# EAGLE design mainBoard (EAGLE 6.3)
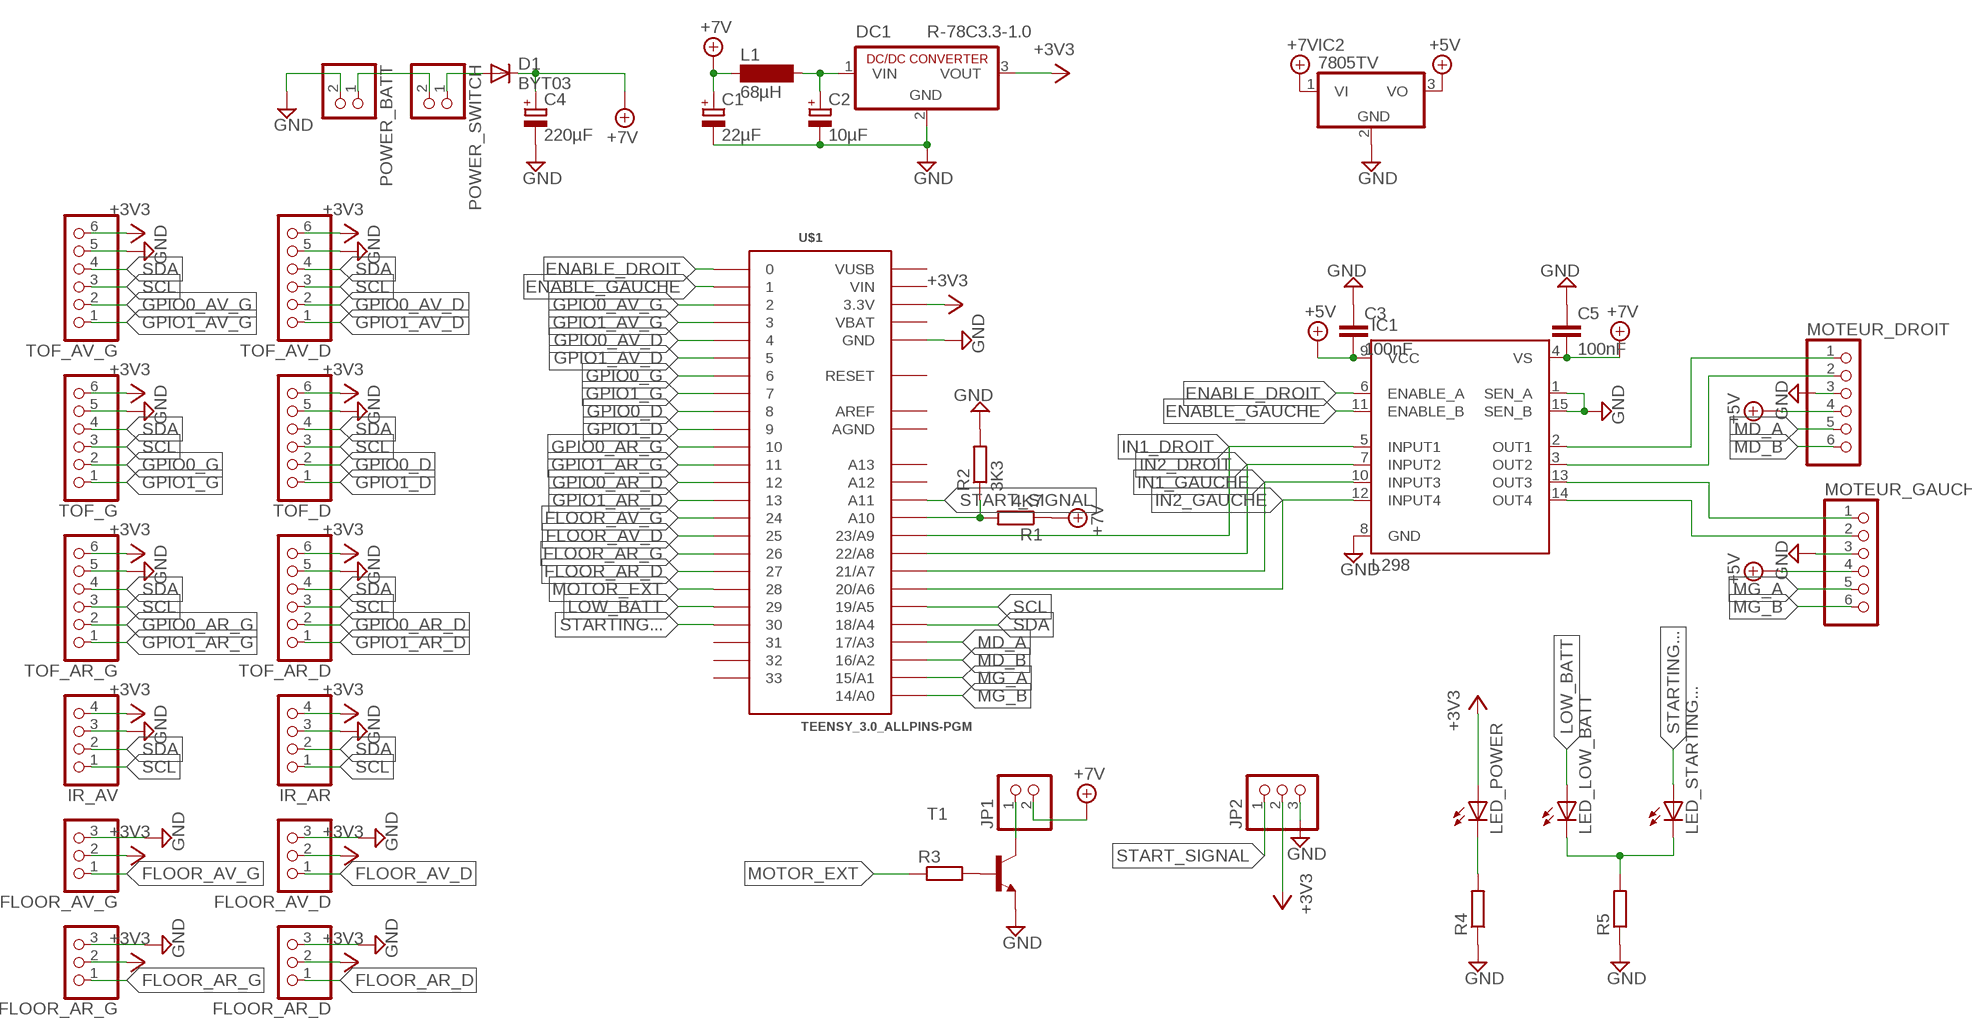
[diagram p0: schematic, sheet 1]

## Parts
C1  22µF  CPOL-EUE2,5-6E  [E2,5-6E]
C2  10µF  CPOL-EUE2,5-6E  [E2,5-6E]
C3  100nF  C-EU050-024X044  [C050-024X044]
C4  220µF  CPOL-EUE2.5-7  [E2,5-7]
C5  100nF  C-EU050-024X044  [C050-024X044]
D1  BYT03  [DO27-15]
DC1  R-78C3.3-1.0  [SIP3]
FLOOR_AR_D  PINHD-1X3  [1X03]
FLOOR_AR_G  PINHD-1X3  [1X03]
FLOOR_AV_D  PINHD-1X3  [1X03]
FLOOR_AV_G  PINHD-1X3  [1X03]
IC1  L298  [MULTIWATT-15]
IC2  7805TV  [TO220V]
IR_AR  PINHD-1X4  [1X04]
IR_AV  PINHD-1X4  [1X04]
JP1  PINHD-1X2  [1X02]
JP2  PINHD-1X3  [1X03]
L1  68µH  BS11  [BS11]
LED_LOW_BATT  LED3MM  [LED3MM]
LED_POWER  LED3MM  [LED3MM]
LED_STARTING...  LED3MM  [LED3MM]
MOTEUR_DROIT  PINHD-1X6  [1X06]
MOTEUR_GAUCHE  PINHD-1X6  [1X06]
POWER_BATT  PINHD-1X2  [1X02]
POWER_SWITCH  PINHD-1X2  [1X02]
R1  4K7  R-EU_0204/7  [0204/7]
R2  3K3  R-EU_0204/7  [0204/7]
R3  R-EU_0204/7  [0204/7]
R4  R-EU_0204/7  [0204/7]
R5  R-EU_0207/2V  [0207/2V]
T1  2N4124-NPN-TO92-CBE  [TO92-CBE]
TOF_AR_D  PINHD-1X6  [1X06]
TOF_AR_G  PINHD-1X6  [1X06]
TOF_AV_D  PINHD-1X6  [1X06]
TOF_AV_G  PINHD-1X6  [1X06]
TOF_D  PINHD-1X6  [1X06]
TOF_G  PINHD-1X6  [1X06]
U$1  TEENSY_3.0_ALLPINS-PGM  [TEENSY_3.0_ALLPINS-PGM]

## Nets
+3V3: DC1.3(VOUT) FLOOR_AR_D.2 FLOOR_AR_G.2 FLOOR_AV_D.2 FLOOR_AV_G.2 IR_AR.4 IR_AV.4 JP2.2 LED_POWER.A TOF_AR_D.6 TOF_AR_G.6 TOF_AV_D.6 TOF_AV_G.6 TOF_D.6 TOF_G.6 U$1.3.3V U$1.3.3V1(3.3V) U$1.3.3V2(3.3V)
+5V: C3.2 IC1.9(VCC) IC2.3(VO) MOTEUR_DROIT.4 MOTEUR_GAUCHE.4
+7V: C1.+ C4.+ C5.2 D1.C IC1.4(VS) IC2.1(VI) JP1.2 L1.1 R1.1
ENABLE_DROIT: IC1.6(ENABLE_A) U$1.0
ENABLE_GAUCHE: IC1.11(ENABLE_B) U$1.1
FLOOR_AR_D: FLOOR_AR_D.1 U$1.27
FLOOR_AR_G: FLOOR_AR_G.1 U$1.26
FLOOR_AV_D: FLOOR_AV_D.1 U$1.25
FLOOR_AV_G: FLOOR_AV_G.1 U$1.24
GND: C1.- C2.- C3.1 C4.- C5.1 DC1.2(GND) FLOOR_AR_D.3 FLOOR_AR_G.3 FLOOR_AV_D.3 FLOOR_AV_G.3 IC1.1(SEN_A) IC1.8(GND) IC1.15(SEN_B) IC2.2(GND) IR_AR.3 IR_AV.3 JP2.3 MOTEUR_DROIT.3 MOTEUR_GAUCHE.3 POWER_BATT.2 R2.2 R4.1 R5.1 T1.E TOF_AR_D.5 TOF_AR_G.5 TOF_AV_D.5 TOF_AV_G.5 TOF_D.5 TOF_G.5 U$1.GND U$1.GND1(GND) U$1.GND2(GND)
GPIO0_AR_D: TOF_AR_D.2 U$1.12
GPIO0_AR_G: TOF_AR_G.2 U$1.10
GPIO0_AV_D: TOF_AV_D.2 U$1.4
GPIO0_AV_G: TOF_AV_G.2 U$1.2
GPIO0_D: TOF_D.2 U$1.8
GPIO0_G: TOF_G.2 U$1.6
GPIO1_AR_D: TOF_AR_D.1 U$1.13
GPIO1_AR_G: TOF_AR_G.1 U$1.11
GPIO1_AV_D: TOF_AV_D.1 U$1.5
GPIO1_AV_G: TOF_AV_G.1 U$1.3
GPIO1_D: TOF_D.1 U$1.9
GPIO1_G: TOF_G.1 U$1.7
IN1_DROIT: IC1.5(INPUT1) U$1.23/A9
IN1_GAUCHE: IC1.10(INPUT3) U$1.21/A7
IN2_DROIT: IC1.7(INPUT2) U$1.22/A8
IN2_GAUCHE: IC1.12(INPUT4) U$1.20/A6
LOW_BATT: LED_LOW_BATT.A U$1.29
MD_A: MOTEUR_DROIT.5 U$1.17/A3
MD_B: MOTEUR_DROIT.6 U$1.16/A2
MD_OUT_A: IC1.2(OUT1) MOTEUR_DROIT.1
MD_OUT_B: IC1.3(OUT2) MOTEUR_DROIT.2
MG_A: MOTEUR_GAUCHE.5 U$1.15/A1
MG_B: MOTEUR_GAUCHE.6 U$1.14/A0
MG_OUT_A: IC1.13(OUT3) MOTEUR_GAUCHE.1
MG_OUT_B: IC1.14(OUT4) MOTEUR_GAUCHE.2
MOTOR_EXT: R3.1 U$1.28
N$1: R3.2 T1.B
N$2: C2.+ DC1.1(VIN) L1.2
N$3: JP1.1 T1.C
N$4: POWER_BATT.1 POWER_SWITCH.2
N$5: D1.A POWER_SWITCH.1
N$7: LED_POWER.K(C) R4.2
N$8: R1.2 R2.1 U$1.A10
N$9: LED_LOW_BATT.K(C) LED_STARTING....K(C) R5.2
SCL: IR_AR.1 IR_AV.1 TOF_AR_D.3 TOF_AR_G.3 TOF_AV_D.3 TOF_AV_G.3 TOF_D.3 TOF_G.3 U$1.19/A5
SDA: IR_AR.2 IR_AV.2 TOF_AR_D.4 TOF_AR_G.4 TOF_AV_D.4 TOF_AV_G.4 TOF_D.4 TOF_G.4 U$1.18/A4
START_SIGNAL: JP2.1 U$1.A11
STARTING...: LED_STARTING....A U$1.30
Unconnected: U$1.31 U$1.32 U$1.33 U$1.A12 U$1.A13 U$1.RST(RESET)

## Power pins joined to a net without a drawn wire
AGND: U$1.AGND
AREF: U$1.AREF
VBAT: U$1.VBAT
VIN: U$1.VIN
VUSB: U$1.VUSB

## Library data of the parts
C1 C2 C4 = resistor:CPOL-EU: POLARIZED CAPACITOR, European symbol
C3 C5 = resistor:C-EU: CAPACITOR, European symbol
D1 = diode:BYT03: DIODE ultra fast
DC1 = dc-dc-converter:R-78C*-1.0: INNOLINE DC/DC-Converter 1.0 AMP SIP3 Single Output Source: Data sheet <http://www.mikrocontroller.net/attachment/150645/157764-da-01-en-DC_DC_WANDLER_R_78C5_0_1_0.pdf>
FLOOR_AR_D FLOOR_AR_G FLOOR_AV_D FLOOR_AV_G JP2 = pinhead:PINHD-1X3: PIN HEADER
IC1 = st-microelectronics:L298: DUAL FULL-BRIDGE DRIVER; MPN: L298N; OC_FARNELL: 1589425; OC_NEWARK: 32M1527
IC2 = linear:78*: Positive VOLTAGE REGULATOR Source: http://cache.national.com/ds/LM/LM78L05.pdf http://www.fairchildsemi.com/ds/LM/LM7805.pdf
IR_AR IR_AV = pinhead:PINHD-1X4: PIN HEADER
JP1 POWER_BATT POWER_SWITCH = pinhead:PINHD-1X2: PIN HEADER
L1 = inductor-neosid:BS: INDUCTOR nominal inductance, magnetically screened; OC_FARNELL: unknown; OC_NEWARK: unknown
LED_LOW_BATT LED_POWER LED_STARTING... = led:LED: LED OSRAM: - CHIPLED LG R971, LG N971, LY N971, LG Q971, LY Q971, LO R971, LY R971 LH N974, LH R974 LS Q976, LO Q976, LY Q976 LO Q996 - Hyper CHIPLED LW Q18S LB Q993, LB Q99A, LB R99A - SideLED LS A670, LO A670, LY A670, LG A670, LP A670 LB A673, LV A673, LT A673, LW A673 LH A674 LY A675 LS A676, LA A676, LO A676, LY A676, LW A676 LS A679, LY A679, LG A679 - Hyper Micro SIDELED® LS Y876, LA Y876, LO Y876, LY Y876 LT Y87S - SmartLED LW L88C, LW L88S LB L89C, LB L89S, LG L890 LS L89K, LO L89K, LY L89K LS L896, LA L896, LO L896, LY L896 - TOPLED LS T670, LO T670, LY T670, LG T670, LP T670 LSG T670, LSP T670, LSY T670, LOP T670, LYG T670 LG T671, LOG T671, LSG T671 LB T673, LV T673, LT T673, LW T673 LH T674 LS T676, LA T676, LO T676, LY T676, LB T676, LH T676, LSB T676, LW T676 LB T67C, LV T67C, LT T67C, LS T67K, LO T67K, LY T67K, LW E67C LS E67B, LA E67B, LO E67B, LY E67B, LB E67C, LV E67C, LT E67C LW T67C LS T679, LY T679, LG T679 LS T770, LO T770, LY T770, LG T770, LP T770 LB T773, LV T773, LT T773, LW T773 LH T774 LS E675, LA E675, LY E675, LS T675 LS T776, LA T776, LO T776, LY T776, LB T776 LHGB T686 LT T68C, LB T68C - Hyper Mini TOPLED® LB M676 - Mini TOPLED Santana® LG M470 LS M47K, LO M47K, LY M47K Source: http://www.osram.convergy.de LUXEON: - LUMILED® LXK2-PW12-R00, LXK2-PW12-S00, LXK2-PW14-U00, LXK2-PW14-V00 LXK2-PM12-R00, LXK2-PM12-S00, LXK2-PM14-U00 LXK2-PE12-Q00, LXK2-PE12-R00, LXK2-PE12-S00, LXK2-PE14-T00, LXK2-PE14-U00 LXK2-PB12-K00, LXK2-PB12-L00, LXK2-PB12-M00, LXK2-PB14-N00, LXK2-PB14-P00, LXK2-PB14-Q00 LXK2-PR12-L00, LXK2-PR12-M00, LXK2-PR14-Q00, LXK2-PR14-R00 LXK2-PD12-Q00, LXK2-PD12-R00, LXK2-PD12-S00 LXK2-PH12-R00, LXK2-PH12-S00 LXK2-PL12-P00, LXK2-PL12-Q00, LXK2-PL12-R00 Source: www.luxeon.com KINGBRIGHT: KA-3528ASYC Source: www.kingbright.com
MOTEUR_DROIT MOTEUR_GAUCHE TOF_AR_D TOF_AR_G TOF_AV_D TOF_AV_G TOF_D TOF_G = pinhead:PINHD-1X6: PIN HEADER
R1-R5 = resistor:R-EU_: RESISTOR, European symbol
T1 = transistor:*-NPN-: NPN Transistror BF959 corrected 2008.03.06
U$1 = Teensy3.0:TEENSY_3.0_ALLPINS-PGM: Teensy 3.0 board outline with all pins and pads enabled except 'PGM' pin. For more basic versions, see 'Basic', '+4', and 'AllAnalogPins'. Requires the installation of a un-shrouded SMD header on the underside of the Teensy 3.0

## Board
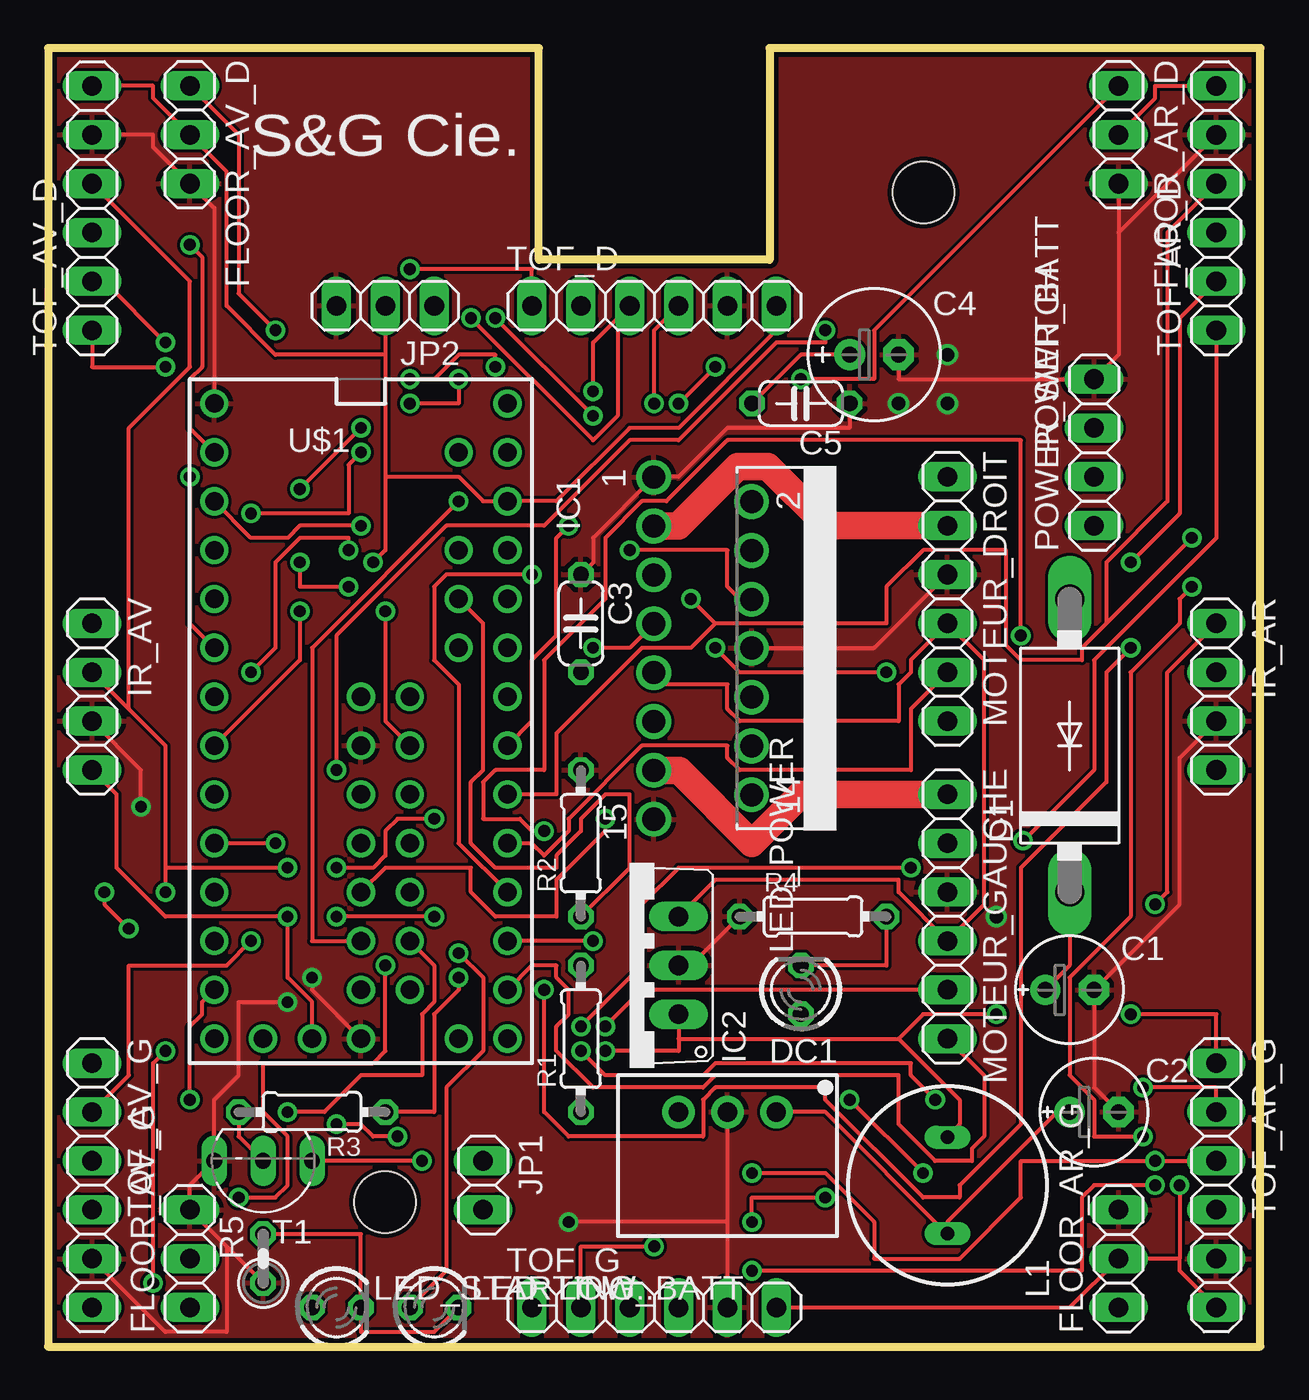
[diagram p1: board, top side]
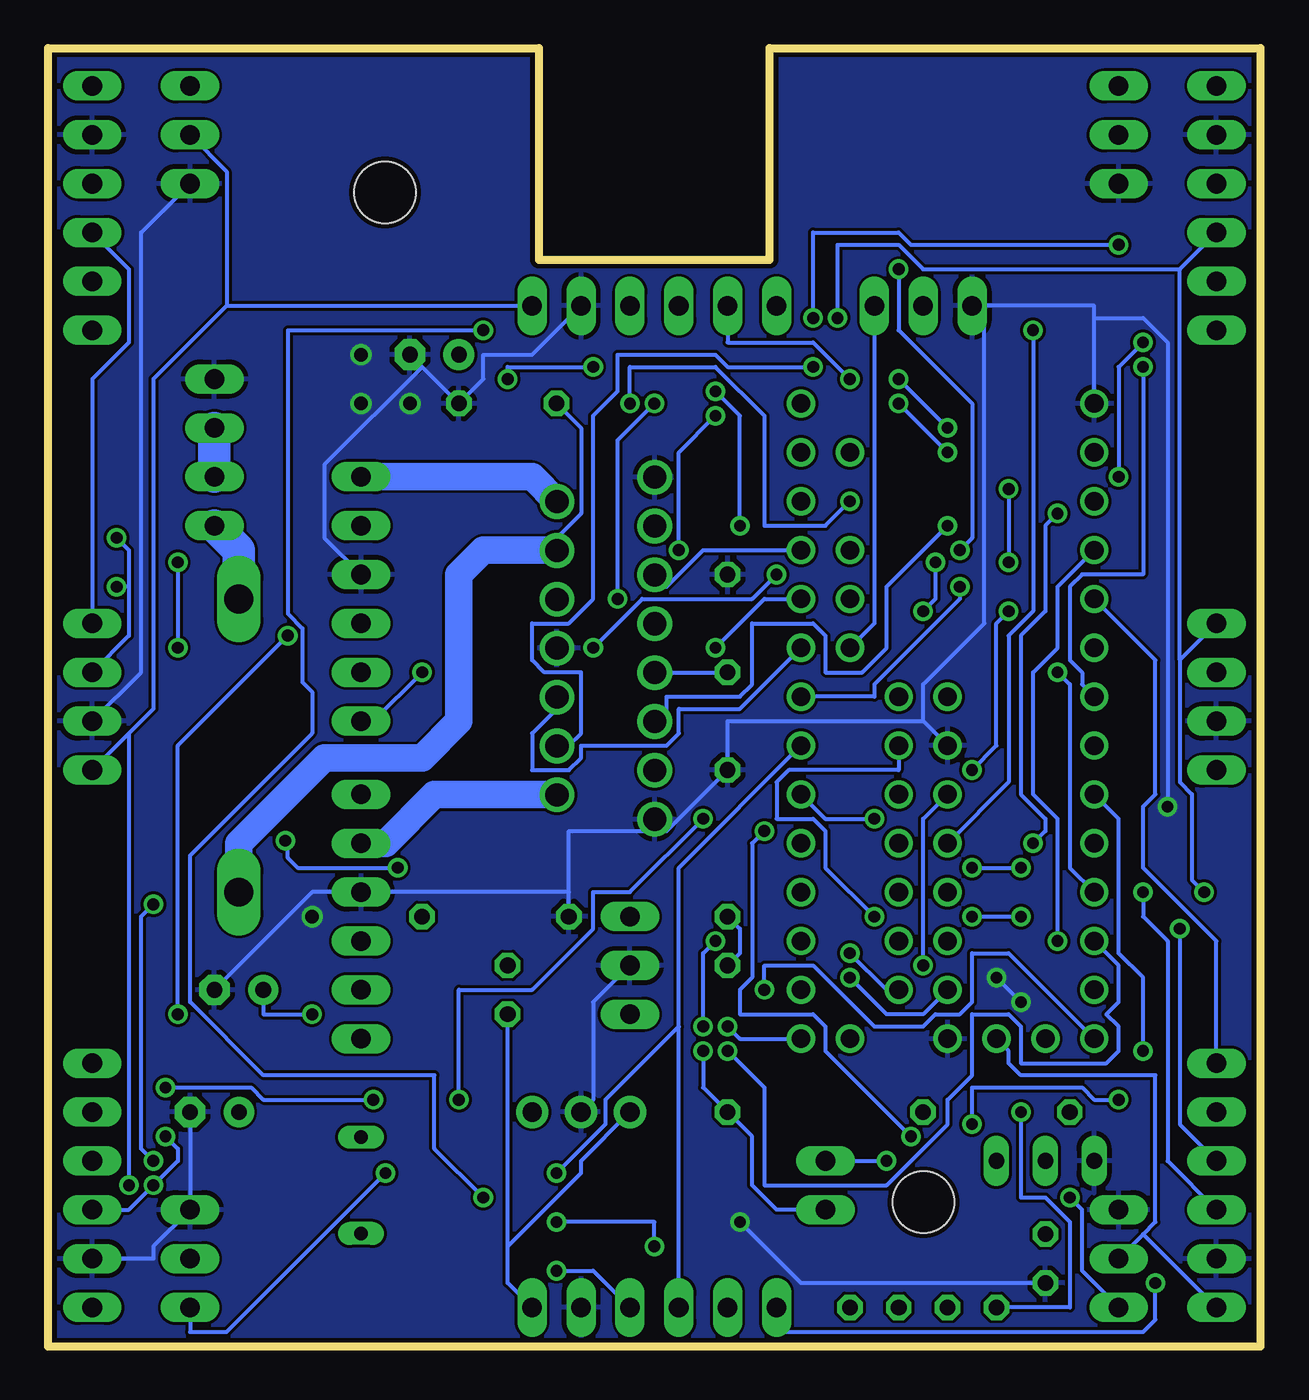
[diagram p2: board, bottom side, seen from below]

Size 63 x 67.5 mm. Coordinates in mm from the lower left corner, seen from the top.
Outline: 0,0 63,0 63,67.5 37.5,67.5 37.5,56.5 25.5,56.5 25.5,67.5 0,67.5 0,0
Copper layers (1*16): Top 0.035mm / dielectric 1.5mm / Bottom 0.035mm
Design rules "default *": minimum track width 8mil, minimum drill 24mil, track to track 6mil, track to pad 6mil, pad to pad 6mil, via to via 6mil, smd to smd 6mil, copper to edge 10mil, drill to drill 8mil, minimum pad ring 10mil, minimum via ring 8mil, stop-mask expansion 4mil, vias tented up to drill 0mil, thermal gap 10mil
Holes 3.2 mm at 17.5,7.5 45.5,60

### Footprints (pad centres in the part's own frame; a part is rotated, then mirrored left to right if it is on the bottom)
E2,5-6E = drill 0.813 pad 1.575: + -1.27,0 | drill 0.813 pad 1.575 octagon: - 1.27,0
C050-024X044 = drill 0.813 octagon: 1 -2.54,0; 2 2.54,0
E2,5-7 = drill 0.813 pad 1.6: + -1.27,0 | drill 0.813 pad 1.6 octagon: - 1.27,0
DO27-15 = drill 1.499 long: A 7.62,0; C -7.62,0
SIP3 = drill 1 pad 1.676: 1 -2.54,0; 2 0,0; 3 2.54,0
1X03 = drill 1.016 long: 1 -2.54,0; 2 0,0; 3 2.54,0
MULTIWATT-15 = drill 1.2: 1 -8.89,-7.62; 2 -7.62,-2.54; 3 -6.35,-7.62; 4 -5.08,-2.54; 5 -3.81,-7.62; 6 -2.54,-2.54; 7 -1.27,-7.62; 8 0,-2.54; 9 1.27,-7.62; 10 2.54,-2.54; 11 3.81,-7.62; 12 5.08,-2.54; 13 6.35,-7.62; 14 7.62,-2.54; 15 8.89,-7.62
TO220V = drill 1.016 long: 1 -2.54,-2.54; 2 0,-2.54; 3 2.54,-2.54
1X04 = drill 1.016 long: 1 -3.81,0; 2 -1.27,0; 3 1.27,0; 4 3.81,0
1X02 = drill 1.016 long: 1 -1.27,0; 2 1.27,0
BS11 = drill 0.7 long: 1 -2.5,0; 2 2.5,0
LED3MM = drill 0.813 octagon: A -1.27,0; K 1.27,0
1X06 = drill 1.016 long: 1 -6.35,0; 2 -3.81,0; 3 -1.27,0; 4 1.27,0; 5 3.81,0; 6 6.35,0
0204/7 = drill 0.813 octagon: 1 -3.81,0; 2 3.81,0
0207/2V = drill 0.813 octagon: 1 -1.27,0; 2 1.27,0
TO92-CBE = drill 0.813 long: B 0,0; C -2.54,0; E 2.54,0
TEENSY_3.0_ALLPINS-PGM = drill 0.965: 0 -6.35,16.51; 1 -6.35,13.97; 2 -6.35,11.43; 3 -6.35,8.89; 3.3V 8.89,13.97; 3.3V1 -1.27,-13.97; 3.3V2 3.81,1.27; 4 -6.35,6.35; 5 -6.35,3.81; 6 -6.35,1.27; 7 -6.35,-1.27; 8 -6.35,-3.81; 9 -6.35,-6.35; 10 -6.35,-8.89; 11 -6.35,-11.43; 12 -6.35,-13.97; 13 8.89,-13.97; 14/A0 8.89,-11.43; 15/A1 8.89,-8.89; 16/A2 8.89,-6.35; 17/A3 8.89,-3.81; 18/A4 8.89,-1.27; 19/A5 8.89,1.27; 20/A6 8.89,3.81; 21/A7 8.89,6.35; 22/A8 8.89,8.89; 23/A9 8.89,11.43; 24 1.27,-1.27; 25 1.27,-3.81; 26 1.27,-6.35; 27 1.27,-8.89; 28 1.27,-11.43; 29 3.81,-11.43; 30 3.81,-8.89; 31 3.81,-6.35; 32 3.81,-3.81; 33 3.81,-1.27; A10 6.35,8.89; A11 6.35,6.35; A12 1.27,3.81; A13 3.81,3.81; AGND 8.89,16.51; AREF 6.35,11.43; GND -6.35,19.05; GND1 1.27,-13.97; GND2 1.27,1.27; RST 6.35,-13.97; VBAT -3.81,-13.97; VIN 8.89,19.05; VUSB 6.35,16.51

### Placement (x,y rotation side)
C1  53.09,18.54 0 top
C2  54.36,12.19 0 top
C3  27.69,37.59 270 top
C4  42.93,51.56 0 top
C5  39.12,49.02 180 top
D1  53.09,31.24 90 top
DC1  35.31,12.19 180 top
FLOOR_AR_D  55.63,62.99 270 top
FLOOR_AR_G  55.63,4.57 90 top
FLOOR_AV_D  7.37,62.99 270 top
FLOOR_AV_G  7.37,4.57 90 top
IC1  39.1,36.3 270 top
IC2  30.23,19.81 90 top
IR_AR  60.71,33.78 270 top
IR_AV  2.29,33.78 270 top
JP1  22.61,8.38 270 top
JP2  17.53,54.1 180 top
L1  46.74,8.38 270 top
LED_LOW_BATT  20.07,2.03 0 top
LED_POWER  39.12,18.54 90 top
LED_STARTING...  14.99,2.03 0 top
MOTEUR_DROIT  46.74,38.86 270 top
MOTEUR_GAUCHE  46.74,22.35 270 top
POWER_BATT  54.36,49.02 90 top
POWER_SWITCH  54.36,43.94 90 top
R1  27.69,16 90 top
R2  27.69,26.16 90 top
R3  13.72,12.19 180 top
R4  39.75,22.35 0 top
R5  11.18,4.57 90 top
T1  11.18,9.65 180 top
TOF_AR_D  60.71,59.18 90 top
TOF_AR_G  60.71,8.38 270 top
TOF_AV_D  2.29,59.18 90 top
TOF_AV_G  2.29,8.38 270 top
TOF_D  31.5,54.1 0 top
TOF_G  31.5,2.03 0 top
U$1  14.99,29.97 0 top

### Tracks (layer width: path | path; a pad name or v marks a point on that pad's centre or on a via)
+3V3  (via drill 0.61)
  Top 0.203: IR_AV.4 3.56,28.7 3.56,24.89 6.1,22.35 v12.45,22.35 12.45,19.18 13.72,17.91 U$1.3.3V1 | TOF_AV_D.6 5.46,65.53 5.46,64.9 FLOOR_AV_D.2 9.27,61.09 9.27,54.1 11.81,51.56 17.53,51.56 | U$1.3.3V2 17.53,32.51 v17.53,38.23 | v16.89,40.77 17.53,41.4 17.53,45.21 | JP2.2 17.53,51.56 | 17.53,51.56 17.53,45.21 | 17.53,45.21 21.34,45.21 22.61,43.94 U$1.3.3V 26.42,43.94 30.23,47.75 32.77,47.75 37.85,52.83 TOF_D.6 | v20.07,22.35 v14.99,22.35 | 58.8,4.57 FLOOR_AR_G.2 53.09,2.03 TOF_G.6 | 58.8,4.57 58.8,3.94 TOF_AR_G.6 | TOF_AR_D.6 57.53,65.53 57.53,64.9 FLOOR_AR_D.2 | v58.8,8.38 58.8,4.57
  Bottom 0.203: U$1.3.3V1 13.08,15.37 13.08,14.73 12.45,14.1 5.46,14.1 5.46,6.48 6.1,5.84 | FLOOR_AV_G.2 6.1,5.84 | 6.1,5.84 TOF_AV_G.6 | v17.53,38.23 16.89,38.86 v16.89,40.77 | v14.99,22.35 v12.45,22.35 | v20.07,22.35 22.61,24.89 22.61,26.8 23.24,27.43 25.15,27.43 25.15,29.34 24.51,29.97 18.8,29.97 U$1.3.3V2 | 39.12,5.21 39.12,3.3 TOF_G.6 | 39.12,5.21 LED_POWER.A | DC1.3 35.31,9.65 35.31,9.02 39.12,5.21 | 53.72,54.1 TOF_D.6 | 53.72,54.1 53.72,61.09 FLOOR_AR_D.2 | 58.8,31.88 57.53,33.15 57.53,50.29 53.72,54.1 | 58.8,31.88 IR_AR.4 | 58.8,31.88 v58.8,8.38
+5V
  Top 0.203: IC2.3 34.67,24.26 44.2,24.26 44.2,23.62 MOTEUR_GAUCHE.4 48.64,22.99 48.64,35.69 MOTEUR_DROIT.4 44.83,35.69 44.83,35.05 44.2,34.42 44.2,32.51 35.94,32.51 35.31,33.15 35.31,34.42 31.5,34.42 IC1.9
  Bottom 0.203: C3.2 30.86,35.05 IC1.9
+7V  (via drill 0.61)
  Top 0.203: 44.2,16 47.37,12.83 47.37,11.56 46.74,10.92 L1.1 | 32.77,16 44.2,16 | IC2.1 32.77,16 | v28.96,15.37 32.77,15.37 32.77,16 | C1.+ 53.09,19.81 D1.C | C5.2 39.12,51.56 C4.+ | 44.2,16 45.47,17.27 v49.28,17.27
  Bottom 0.203: JP1.2 25.15,7.11 26.42,8.38 26.42,10.92 R1.1 28.96,13.46 v28.96,15.37 | C5.2 35.31,47.75 35.31,43.31 36.58,42.04 IC1.4 | v49.28,17.27 51.82,17.27 C1.+
  Bottom 1.422: D1.C 53.09,26.16 48.64,30.61 43.56,30.61 41.66,32.51 41.66,40.13 40.39,41.4 36.58,41.4 IC1.4
ENABLE_DROIT  (via drill 0.61)
  Top 0.203: U$1.0 7.37,47.75 7.37,50.29 8,50.93 8,56.64 v7.37,57.28 | v28.32,48.39 v23.24,53.47 | v30.23,41.4 35.31,41.4 35.31,39.5 35.94,38.86 IC1.6
  Bottom 0.203: v7.37,57.28 18.16,57.28 18.8,57.91 23.24,57.91 v23.24,53.47 | v28.32,48.39 30.23,46.48 v30.23,41.4
ENABLE_GAUCHE  (via drill 0.61)
  Top 0.203: U$1.1 10.54,42.04 12.45,42.04 13.08,42.67 v16.26,42.67
  Bottom 0.203: v16.26,42.67 19.43,39.5 19.43,36.32 20.7,35.05 22.61,35.05 22.61,36.96 23.24,37.59 26.42,37.59 26.42,34.42 27.05,33.78 30.86,33.78 30.86,32.51 IC1.11
FLOOR_AR_D  (via drill 0.61)
  Top 0.203: U$1.27 13.72,21.08 13.72,36.32 v21.34,43.94 | v34.67,50.93 v32.77,49.02 | v39.12,50.29 42.93,50.29 42.93,52.83 FLOOR_AR_D.1
  Bottom 0.203: v21.34,43.94 22.61,42.67 25.78,42.67 25.78,48.39 28.32,50.93 32.77,50.93 v32.77,49.02 | v34.67,50.93 39.12,50.93 v39.12,50.29
FLOOR_AR_G  (via drill 0.61)
  Top 0.203: U$1.26 17.53,24.89 21.97,24.89 21.97,23.62 23.24,22.35 26.42,22.35 26.42,24.26 28.96,26.8 v28.96,27.43 | v45.47,9.02 v41.66,12.83
  Bottom 0.203: v28.96,27.43 32.77,23.62 34.67,23.62 34.67,21.72 37.85,18.54 41.66,18.54 v41.66,12.83 | v45.47,9.02 53.72,0.76 55.63,0.76 FLOOR_AR_G.1
FLOOR_AV_D  (via drill 0.61)
  Top 0.203: v11.81,52.83 9.91,54.74 9.91,62.99 FLOOR_AV_D.1
  Bottom 0.203: U$1.25 13.08,29.34 13.08,36.96 11.81,38.23 v11.81,52.83
FLOOR_AV_G  (via drill 0.61)
  Top 0.203: v17.53,19.81 17.53,15.37 16.89,14.73 11.18,14.73 11.18,12.19 12.45,10.92 12.45,8.38 11.81,7.75 v9.91,7.75
  Bottom 0.203: U$1.24 17.53,27.43 v17.53,19.81 | v9.91,7.75 9.27,7.11 9.27,3.94 FLOOR_AV_G.1
GND  (via drill 0.61, 0.7)
  Top 0.203: FLOOR_AR_D.3 55.63,57.91 | 55.63,57.91 55.63,51.56 POWER_BATT.2 44.2,50.29 C4.- | 55.63,57.91 TOF_AR_D.5 | MOTEUR_DROIT.3 42.93,36.32 36.58,36.32 IC1.8 | C3.1 28.32,40.77 28.32,42.04 IC1.1 31.5,45.21 32.77,45.21 35.31,47.75 41.66,47.75 C5.1 | U$1.GND 8.64,59.18 FLOOR_AV_D.3 5.46,62.36 5.46,62.99 TOF_AV_D.5 | IR_AV.3 4.83,29.97 v4.83,28.07 | IR_AR.3 58.8,30.61 58.8,22.99 C1.- 54.36,13.46 C2.- | 9.27,5.21 FLOOR_AV_G.3 7.37,8.38 T1.E 8.64,12.83 9.91,14.1 9.91,17.91 v12.45,17.91 | 9.27,5.21 R5.1 | U$1.GND1 13.72,18.54 v13.72,19.18 | TOF_AV_G.5 6.1,0.76 9.27,0.76 9.27,5.21 | DC1.2 35.31,6.48 | 35.31,6.48 TOF_G.5 | R4.1 33.4,19.81 IC2.2 | 35.31,6.48 v27.05,6.48
  Bottom 0.203: C4.- 43.56,50.93 | 43.56,50.93 C5.1 40.39,50.29 40.39,51.56 37.85,51.56 TOF_D.5 | MOTEUR_DROIT.3 48.64,42.04 48.64,45.85 43.56,50.93 | v4.83,28.07 4.83,52.2 6.1,53.47 8.64,53.47 | U$1.GND 8.64,53.47 | 14.35,54.1 8.64,54.1 8.64,53.47 | C2.- FLOOR_AR_G.3 57.53,5.21 57.53,4.57 TOF_AR_G.5 | v12.45,17.91 v13.72,19.18 | 17.53,32.51 U$1.GND2 | 17.53,32.51 27.69,32.51 R2.2 30.86,26.8 IC1.15 31.5,26.8 35.94,26.8 35.94,23.62 | 35.94,23.62 MOTEUR_GAUCHE.3 49.28,23.62 C1.- | R4.1 35.94,23.62 | DC1.2 34.67,12.83 34.67,17.91 IC2.2 | R5.1 23.88,3.3 v27.05,6.48 | 14.35,54.1 14.35,37.59 17.53,34.42 17.53,32.51 | 14.35,54.1 JP2.3 | FLOOR_AR_D.3 58.17,57.91 58.17,35.05 IR_AR.3
  other vias: 46.74,49.02 46.74,51.56 44.2,49.02 49.28,22.35
  pour Bottom: -1.52,69.34 67.06,69.34 67.06,-0.51 -1.52,-0.51
  pour Top: -1.52,69.34 65.79,69.34 65.79,-0.51 -1.52,-0.51
GPIO0_AR_D  (via drill 0.61)
  Top 0.203: v25.78,18.54 25.78,12.19 27.05,10.92 34.04,10.92 34.04,12.83 34.67,13.46 40.39,13.46 40.39,12.83 45.47,7.75 47.37,7.75 47.37,8.38 50.55,11.56 50.55,24.89 54.99,29.34 54.99,35.05 v56.26,36.32 | v56.26,40.77 58.8,43.31 58.8,53.47 TOF_AR_D.2
  Bottom 0.203: U$1.12 13.08,20.45 14.99,20.45 14.99,17.91 15.62,17.27 16.89,17.27 17.53,16.64 20.07,16.64 23.24,19.81 25.78,19.81 v25.78,18.54 | v56.26,40.77 v56.26,36.32
GPIO0_AR_G  (via drill 0.61)
  Top 0.203: v27.69,15.37 28.96,14.1 34.04,14.1 34.67,14.73 44.83,14.73 44.83,14.1 v46.1,12.83 | v56.9,13.46 60.71,13.46 TOF_AR_G.2
  Bottom 0.203: U$1.10 7.37,19.81 7.37,17.91 8,17.27 7.37,16.64 7.37,15.37 8,14.73 12.45,14.73 12.45,16.64 13.08,17.27 14.99,17.27 14.99,14.1 16.26,12.83 16.26,11.56 19.43,8.38 25.78,8.38 25.78,13.46 v27.69,15.37 | v46.1,12.83 51.82,12.83 52.45,13.46 v56.9,13.46
GPIO0_AV_D  (via drill 0.61)
  Top 0.203: U$1.4 7.37,37.59 v7.37,45.21 | v6.1,52.2 2.92,55.37 TOF_AV_D.2
  Bottom 0.203: v7.37,45.21 7.37,50.93 v6.1,52.2
GPIO0_AV_G  (via drill 0.61)
  Top 0.203: v10.54,21.08 9.27,19.81 4.19,19.81 4.19,14.1 TOF_AV_G.2
  Bottom 0.203: U$1.2 10.54,39.5 10.54,36.32 11.81,35.05 11.81,28.7 10.54,27.43 v10.54,21.08
GPIO0_D  (via drill 0.61)
  Top 0.203: v11.81,26.16 U$1.8 | v10.54,43.31 15.62,43.31 15.62,45.85 v16.26,46.48 | v18.8,49.02 21.34,49.02 v21.34,50.29
  Bottom 0.203: v11.81,26.16 11.18,26.8 11.18,27.43 12.45,28.7 12.45,36.96 11.18,38.23 11.18,42.67 v10.54,43.31 | v18.8,49.02 v16.26,46.48 | v21.34,50.29 23.24,52.2 27.69,52.2 TOF_D.2
GPIO0_G  (via drill 0.61)
  Top 0.203: U$1.6 13.08,35.69 v13.08,38.23 | v14.99,29.97 14.99,36.96 20.7,42.67 25.78,42.67 30.23,47.12 32.77,47.12 37.85,52.2 40.39,52.2 v40.39,52.83 | v40.39,7.75 36.58,7.75 v36.58,6.48 | v31.5,5.21 27.69,5.21 TOF_G.2
  Bottom 0.203: v13.08,38.23 13.72,37.59 13.72,31.24 v14.99,29.97 | v40.39,52.83 50.55,52.83 50.55,38.1 49.78,37.34 49.78,34.54 49.28,34.04 49.28,31.88 55.63,25.53 55.63,17.91 51.82,14.1 42.93,14.1 42.93,10.29 v40.39,7.75 | v36.58,6.48 31.5,6.48 v31.5,5.21
GPIO1_AR_D  (via drill 0.61)
  Top 0.203: v27.69,16.64 30.86,19.81 30.86,22.99 32.77,24.89 v44.83,24.89 | v50.67,26.29 54.36,29.97 54.36,35.69 60.71,42.04 TOF_AR_D.1
  Bottom 0.203: U$1.13 27.05,16 v27.69,16.64 | v44.83,24.89 50.04,24.89 50.55,25.4 50.55,26.16 v50.67,26.29
GPIO1_AR_G  (via drill 0.61)
  Top 0.203: U$1.11 8,17.91 8,17.27 7.37,16.64 v7.37,12.83 | v14.99,11.56 16.26,11.56 16.89,10.92 v18.16,10.92 | v25.78,26.8 25.15,26.8 24.51,27.43 22.61,27.43 22.61,29.34 23.24,29.97 25.78,29.97 25.78,35.69 28.96,38.86 28.96,42.04 30.86,43.94 32.13,43.94 35.31,47.12 50.55,47.12 v50.55,36.96 | v56.26,17.27 60.71,17.27 TOF_AR_G.1
  Bottom 0.203: v7.37,12.83 8.64,12.83 9.27,13.46 14.99,13.46 v14.99,11.56 | v18.16,10.92 22.61,15.37 22.61,16.64 23.24,17.27 27.05,17.27 27.05,18.54 26.42,19.18 26.42,26.16 v25.78,26.8 | v50.55,36.96 56.26,31.24 v56.26,17.27
GPIO1_AV_D  (via drill 0.61)
  Top 0.203: v6.1,50.93 2.29,50.93 TOF_AV_D.1
  Bottom 0.203: U$1.5 9.27,34.42 9.27,35.05 9.91,35.69 9.91,39.5 9.27,40.13 6.1,40.13 v6.1,50.93
GPIO1_AV_G
  Bottom 0.203: U$1.3 5.46,35.69 5.46,28.7 6.1,28.07 6.1,24.89 2.29,21.08 TOF_AV_G.1
GPIO1_D  (via drill 0.61)
  Top 0.203: v10.54,35.05 11.81,36.32 11.81,40.77 13.08,42.04 15.62,42.04 v15.62,41.4 | v18.8,56.01 25.15,56.01 TOF_D.1
  Bottom 0.203: U$1.9 9.91,24.89 9.91,34.42 v10.54,35.05 | v15.62,41.4 14.99,42.04 14.99,49.02 18.8,52.83 v18.8,56.01
GPIO1_G  (via drill 0.61)
  Top 0.203: v6.1,15.37 5.46,14.73 v5.46,3.3
  Bottom 0.203: U$1.7 7.37,27.43 7.37,20.45 6.1,19.18 v6.1,15.37 | v5.46,3.3 5.46,1.4 6.1,0.76 25.15,0.76 TOF_G.1
IN1_DROIT
  Bottom 0.203: U$1.23/A9 28.96,41.4 30.86,39.5 IC1.5
IN1_GAUCHE
  Bottom 0.203: U$1.21/A7 27.05,33.15 30.23,33.15 30.23,31.88 30.86,31.24 35.31,31.24 35.31,30.61 35.94,29.97 37.85,29.97 37.85,31.88 36.58,33.15 IC1.10
IN2_DROIT  (via drill 0.61)
  Top 0.203: v28.32,36.32 30.23,36.32 IC1.7
  Bottom 0.203: U$1.22/A8 25.78,38.86 v28.32,36.32
IN2_GAUCHE  (via drill 0.61)
  Top 0.203: v15.62,39.5 13.08,39.5 v13.08,40.77 | v16.26,47.75 v13.08,44.58 | v18.8,50.29 20.07,50.29 21.34,51.56 23.24,51.56 v23.24,50.93
  Bottom 0.203: U$1.20/A6 20.07,33.78 20.07,34.42 15.62,38.86 v15.62,39.5 | v13.08,44.58 v13.08,40.77 | v18.8,50.29 v16.26,47.75 | v23.24,50.93 27.69,50.93 28.32,51.56 33.4,51.56 33.4,49.66 34.67,48.39 34.67,38.86 35.94,37.59 37.85,37.59 37.85,35.69 37.21,35.05 35.31,35.05 35.31,31.88 35.94,31.24 IC1.12
LOW_BATT  (via drill 0.61)
  Top 0.203: LED_LOW_BATT.A 20.7,3.94 20.7,13.46 22.61,15.37 22.61,19.18 v21.34,20.45
  Bottom 0.203: v21.34,20.45 19.43,18.54 U$1.29
MD_A
  Top 0.203: U$1.17/A3 25.15,26.16 25.78,25.53 27.05,26.8 27.05,27.43 30.86,31.24 35.31,31.24 35.31,30.61 35.94,29.97 44.83,29.97 44.83,33.15 MOTEUR_DROIT.5
MD_B  (via drill 0.61)
  Top 0.203: U$1.16/A2 21.34,26.16 21.34,34.42 20.07,35.69 20.07,39.5 20.7,40.13 v25.15,40.13 | v34.67,36.32 35.94,35.05 v43.56,35.05
  Bottom 0.203: v25.15,40.13 26.42,38.86 32.13,38.86 v34.67,36.32 | v43.56,35.05 46.1,32.51 MOTEUR_DROIT.6
MD_OUT_A
  Bottom 1.422: IC1.2 37.85,45.21 MOTEUR_DROIT.1
MD_OUT_B
  Top 1.422: IC1.3 32.75,42.65 35.84,45.74 37.39,45.74 40.49,42.67 MOTEUR_DROIT.2
MG_A  (via drill 0.61)
  Top 0.203: v28.32,21.08 U$1.15/A1 | v28.96,16.64 30.86,18.54 MOTEUR_GAUCHE.5
  Bottom 0.203: v28.32,21.08 28.96,20.45 v28.96,16.64
MG_B
  Top 0.203: U$1.14/A0 25.15,19.81 26.42,19.81 26.42,19.18 27.05,18.54 27.05,17.27 26.42,16.64 26.42,15.37 28.32,13.46 34.04,13.46 34.67,14.1 44.2,14.1 44.2,11.56 46.1,9.65 48.01,9.65 48.01,10.29 48.64,10.92 48.64,14.1 MOTEUR_GAUCHE.6
MG_OUT_A
  Top 1.422: IC1.13 32.79,29.95 36.58,26.16 39.12,28.7 MOTEUR_GAUCHE.1
MG_OUT_B
  Bottom 1.422: MOTEUR_GAUCHE.2 45.47,26.16 42.93,28.7 36.58,28.7 IC1.14
MOTOR_EXT  (via drill 0.61)
  Top 0.203: R3.1 20.07,12.19 20.07,17.27 21.34,18.54 v21.34,19.18
  Bottom 0.203: v21.34,19.18 19.43,17.27 17.53,17.27 U$1.28
N$1
  Top 0.203: T1.B 9.91,10.92 R3.2
N$2
  Top 0.203: C2.+ 52.45,12.19 46.74,6.48 L1.2 46.74,5.84 40.39,12.19 DC1.1
N$3  (via drill 0.61)
  Top 0.203: v19.43,9.65 T1.C
  Bottom 0.203: JP1.1 v19.43,9.65
N$4
  Bottom 1.676: POWER_BATT.1 POWER_SWITCH.2
N$5
  Bottom 1.676: POWER_SWITCH.1 53.09,41.4 D1.A
N$7
  Top 0.203: LED_POWER.K 43.56,19.81 R4.2
N$8
  Top 0.203: U$1.A10 22.61,37.59 22.61,29.97 21.97,29.34 21.97,26.16 23.24,24.89 26.42,24.89 26.42,25.53 27.69,26.8 27.69,27.43 28.96,28.7 30.23,28.7 30.23,24.89 R2.1
  Bottom 0.203: R1.2 27.05,20.45 27.05,21.72 R2.1
N$9
  Top 0.203: R5.2 16.26,5.84 LED_STARTING....K 16.26,0.76 20.07,0.76 LED_LOW_BATT.K
SCL  (via drill 0.61)
  Top 0.203: v4.19,21.72 2.92,22.99 v2.92,23.62 | 29.59,53.47 28.32,52.2 v28.32,49.66 | v27.05,42.67 26.42,42.04 26.42,36.96 25.15,35.69 25.15,32.51 U$1.19/A5 | TOF_AR_G.3 v57.53,9.65 50.55,9.65 50.55,7.75 47.37,4.57 42.93,4.57 42.93,6.48 40.39,9.02 v36.58,9.02 | IR_AR.1 58.17,35.05 58.17,23.62 v57.53,22.99 | v21.97,53.47 28.32,47.12 29.59,48.39 29.59,53.47 | 29.59,53.47 TOF_D.3
  Bottom 0.203: TOF_AV_G.3 4.19,11.56 v4.19,21.72 | v2.92,23.62 3.56,24.26 3.56,28.7 4.19,29.34 4.19,35.69 | IR_AV.1 4.19,35.69 | 4.19,56.01 TOF_AV_D.3 | 4.19,35.69 4.19,56.01 | IR_AR.1 60.71,50.29 58.8,52.2 58.8,56.01 TOF_AR_D.3 | U$1.19/A5 30.23,24.89 30.23,16.64 | TOF_G.3 30.23,16.64 | v28.32,49.66 27.05,48.39 v27.05,42.67 | v36.58,9.02 34.04,11.56 34.04,12.83 30.23,16.64 | v57.53,22.99 58.17,22.35 58.17,10.29 v57.53,9.65 | 4.19,56.01 17.53,56.01 18.8,57.28 21.97,57.28 v21.97,53.47
SDA  (via drill 0.61)
  Top 0.203: 6.1,24.89 6.1,31.24 4.19,33.15 | 6.1,24.89 v6.1,23.62 | IR_AV.2 4.19,33.15 | TOF_AV_D.4 7.37,55.37 7.37,50.93 4.19,47.75 4.19,33.15 | v36.58,3.94 53.72,3.94 53.72,7.75 54.36,8.38 v57.53,8.38 | U$1.18/A4 26.42,28.7 26.42,31.88 30.86,36.32 33.4,36.32 34.67,37.59 | 34.67,37.59 43.56,37.59 43.56,39.5 45.47,41.4 49.78,41.4 49.78,36.45 50.55,35.69 53.72,35.69 53.72,36.32 54.99,37.59 | 54.99,37.59 54.99,40.77 58.17,43.94 58.17,57.91 TOF_AR_D.4 | TOF_D.4 31.5,52.83 v31.5,49.02 | 34.67,37.59 v33.4,38.86 | 54.99,37.59 v59.44,42.04 | v56.9,10.92 54.36,10.92 54.36,12.83 53.09,14.1 53.09,19.18 56.26,22.35 56.26,35.05 58.8,37.59 58.8,38.86 v59.44,39.5 | v12.45,24.89 6.1,24.89 | v14.99,24.89 16.89,24.89 17.53,25.53 17.53,26.8 18.16,27.43 v20.07,27.43
  Bottom 0.203: TOF_AV_G.4 4.83,9.65 4.83,21.08 6.1,22.35 v6.1,23.62 | TOF_G.4 34.67,3.94 v36.58,3.94 | TOF_AR_G.4 58.8,7.11 v57.53,8.38 56.26,9.65 56.26,10.29 v56.9,10.92 | v31.5,49.02 33.4,47.12 v33.4,38.86 | IR_AR.2 58.8,36.96 58.8,39.5 | 58.8,39.5 58.8,41.4 v59.44,42.04 | 58.8,39.5 v59.44,39.5 | v14.99,24.89 v12.45,24.89 | v20.07,27.43 22.61,27.43 U$1.18/A4
START_SIGNAL
  Bottom 0.203: U$1.A11 20.07,37.59 JP2.1
STARTING...  (via drill 0.61)
  Top 0.203: v12.45,12.19 14.35,12.19 16.26,14.1 19.43,14.1 19.43,17.27 20.07,17.91 20.07,19.81 U$1.30
  Bottom 0.203: LED_STARTING....A 9.91,2.03 9.91,6.48 11.18,7.75 12.45,7.75 v12.45,12.19

### Text on the board
tPlace: S&G Cie.
Reference: Droite | Avant | Arrière | Gauche